# EAGLE design Pot4.4_MCP3008 (EAGLE 7.2.0)
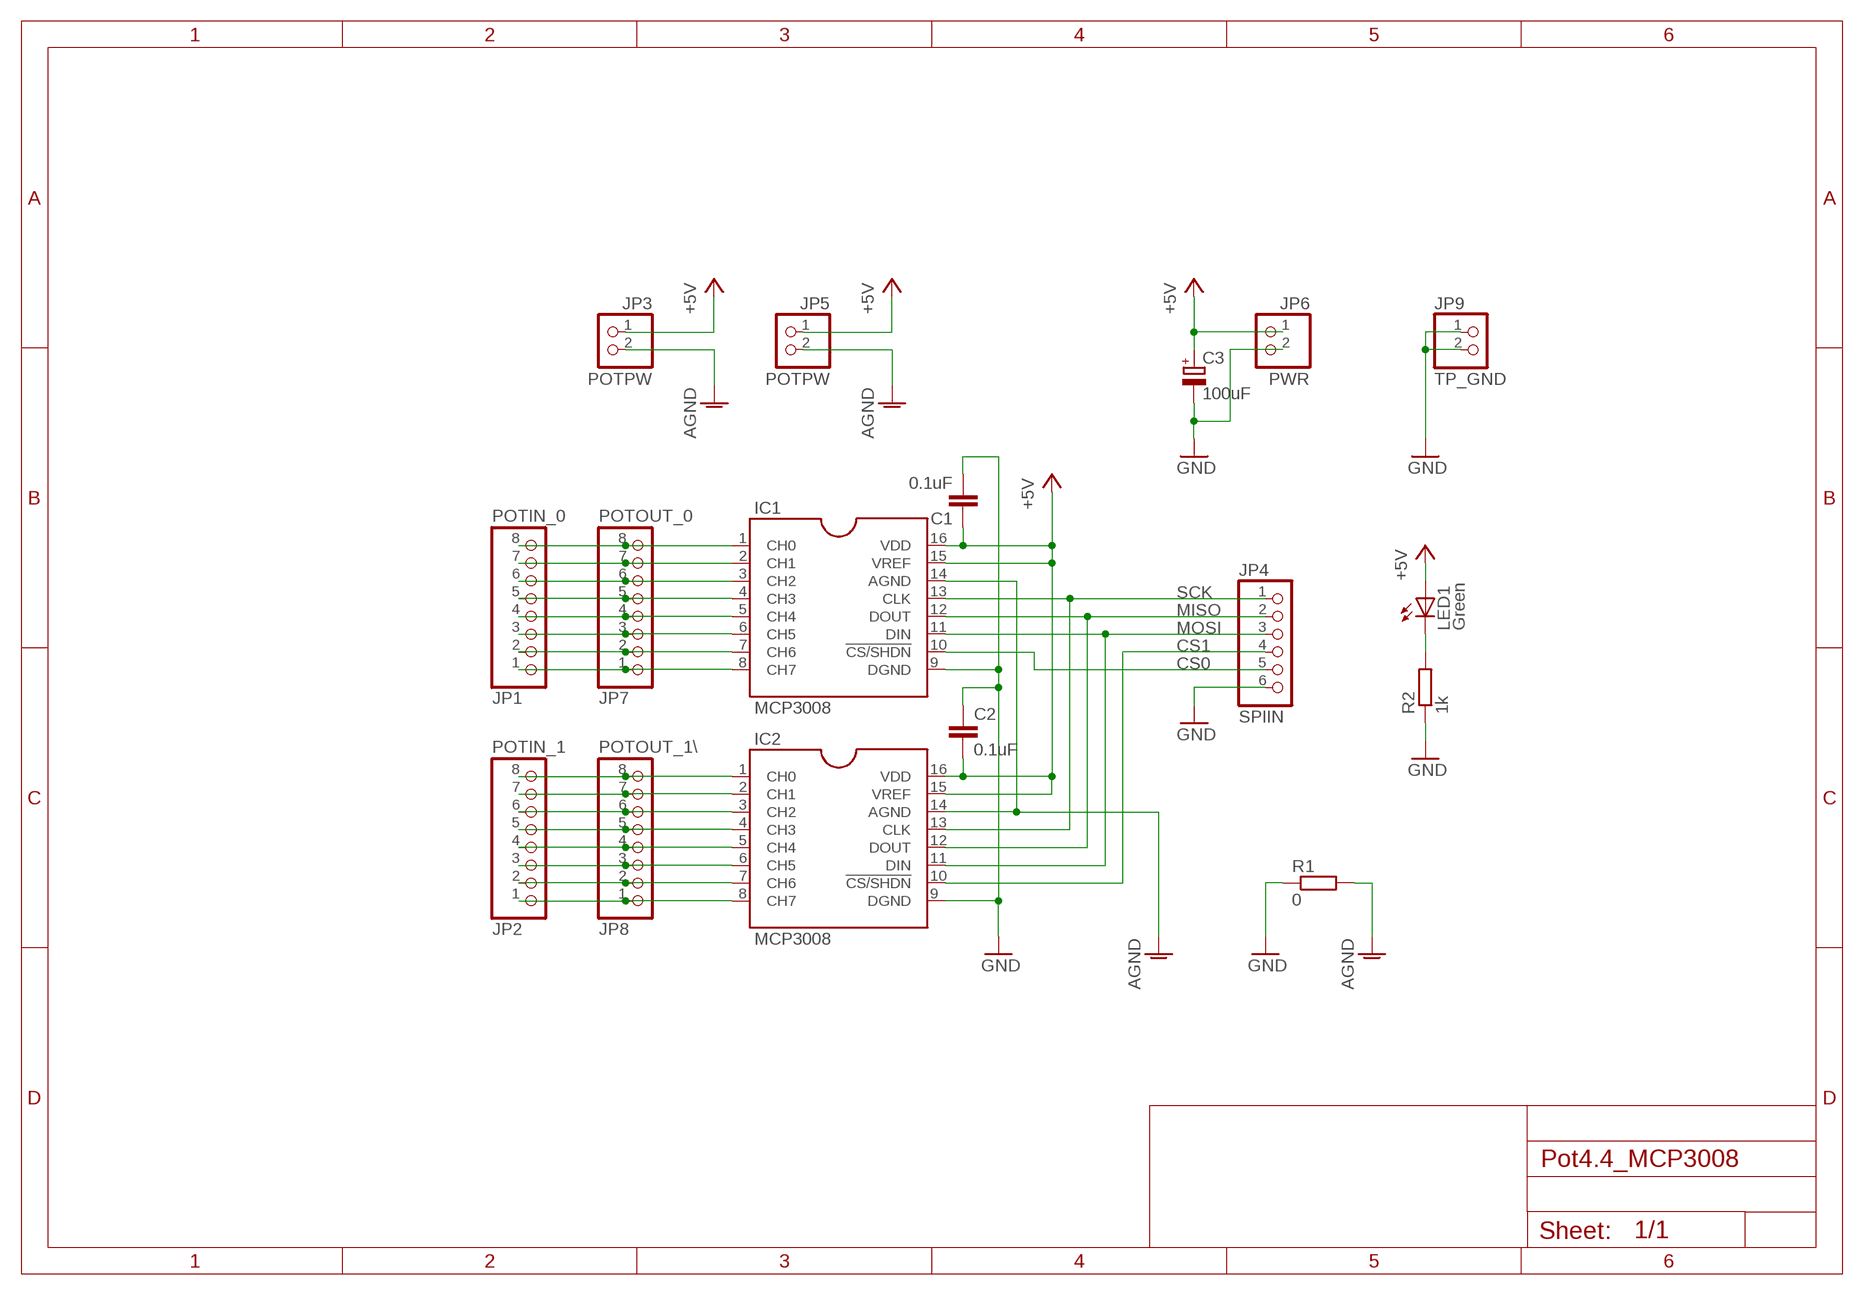
[diagram p0: schematic, sheet 1]

## Parts
C1  0.1uF  C-EU025-024X044  [C025-024X044]
C2  0.1uF  C-EU025-024X044  [C025-024X044]
C3  100uF  CPOL-EUSANYO_C  [SANYO-OSCON_C]
IC1  MCP3008  [MCP3008]
IC2  MCP3008  [MCP3008]
JP1  POTIN_0  PINHD-1X8/90  [1X08/90]
JP2  POTIN_1  PINHD-1X8/90  [1X08/90]
JP3  POTPW  PINHD-1X2/90  [1X02/90]
JP4  SPIIN  PINHD-1X6/90  [1X06/90]
JP5  POTPW  PINHD-1X2/90  [1X02/90]
JP6  PWR  PINHD-1X2/90  [1X02/90]
JP7  POTOUT_0  PINHD-1X8  [1X08]
JP8  POTOUT_1\  PINHD-1X8  [1X08]
JP9  TP_GND  PINHD-1X2  [1X02]
LED1  Green  LED3MM  [LED3MM]
R1  0  R-EU_0204/2V  [0204V]
R2  1k  R-EU_0207/7  [0207/7]

## Nets
+5V: C1.1 C2.2 C3.+ IC1.15(VREF) IC1.16(VDD) IC2.15(VREF) IC2.16(VDD) JP3.1 JP5.1 JP6.1 LED1.A
AGND: IC1.14(AGND) IC2.14(AGND) JP3.2 JP5.2 R1.2
CS0: IC1.10(!CS/SHDN) JP4.5
CS1: IC2.10(!CS/SHDN) JP4.4
GND: C1.2 C2.1 C3.- IC1.9(DGND) IC2.9(DGND) JP4.6 JP6.2 JP9.1 JP9.2 R1.1 R2.1
MISO: IC1.12(DOUT) IC2.12(DOUT) JP4.2
MOSI: IC1.11(DIN) IC2.11(DIN) JP4.3
N$1: IC1.1(CH0) JP1.8 JP7.8
N$2: IC1.2(CH1) JP1.7 JP7.7
N$3: IC1.3(CH2) JP1.6 JP7.6
N$4: IC1.4(CH3) JP1.5 JP7.5
N$5: IC1.5(CH4) JP1.4 JP7.4
N$6: IC1.6(CH5) JP1.3 JP7.3
N$7: IC1.7(CH6) JP1.2 JP7.2
N$8: IC1.8(CH7) JP1.1 JP7.1
N$9: IC2.1(CH0) JP2.8 JP8.8
N$10: IC2.2(CH1) JP2.7 JP8.7
N$11: IC2.3(CH2) JP2.6 JP8.6
N$12: IC2.4(CH3) JP2.5 JP8.5
N$13: IC2.5(CH4) JP2.4 JP8.4
N$14: IC2.6(CH5) JP2.3 JP8.3
N$15: IC2.7(CH6) JP2.2 JP8.2
N$16: IC2.8(CH7) JP2.1 JP8.1
N$18: LED1.K(C) R2.2
SCK: IC1.13(CLK) IC2.13(CLK) JP4.1

## Library data of the parts
C1 C2 = rcl:C-EU: CAPACITOR, European symbol
C3 = rcl:CPOL-EU: POLARIZED CAPACITOR, European symbol
IC1 IC2 = mylib2:MCP3008
JP1 JP2 JP7 JP8 = pinhead:PINHD-1X8: PIN HEADER
JP3 JP5 JP6 JP9 = pinhead:PINHD-1X2: PIN HEADER
JP4 = pinhead:PINHD-1X6: PIN HEADER
LED1 = led:LED: LED OSRAM: - CHIPLED LG R971, LG N971, LY N971, LG Q971, LY Q971, LO R971, LY R971 LH N974, LH R974 LS Q976, LO Q976, LY Q976 LO Q996 - Hyper CHIPLED LW Q18S LB Q993, LB Q99A, LB R99A - SideLED LS A670, LO A670, LY A670, LG A670, LP A670 LB A673, LV A673, LT A673, LW A673 LH A674 LY A675 LS A676, LA A676, LO A676, LY A676, LW A676 LS A679, LY A679, LG A679 - Hyper Micro SIDELED® LS Y876, LA Y876, LO Y876, LY Y876 LT Y87S - SmartLED LW L88C, LW L88S LB L89C, LB L89S, LG L890 LS L89K, LO L89K, LY L89K LS L896, LA L896, LO L896, LY L896 - TOPLED LS T670, LO T670, LY T670, LG T670, LP T670 LSG T670, LSP T670, LSY T670, LOP T670, LYG T670 LG T671, LOG T671, LSG T671 LB T673, LV T673, LT T673, LW T673 LH T674 LS T676, LA T676, LO T676, LY T676, LB T676, LH T676, LSB T676, LW T676 LB T67C, LV T67C, LT T67C, LS T67K, LO T67K, LY T67K, LW E67C LS E67B, LA E67B, LO E67B, LY E67B, LB E67C, LV E67C, LT E67C LW T67C LS T679, LY T679, LG T679 LS T770, LO T770, LY T770, LG T770, LP T770 LB T773, LV T773, LT T773, LW T773 LH T774 LS E675, LA E675, LY E675, LS T675 LS T776, LA T776, LO T776, LY T776, LB T776 LHGB T686 LT T68C, LB T68C - Hyper Mini TOPLED® LB M676 - Mini TOPLED Santana® LG M470 LS M47K, LO M47K, LY M47K Source: http://www.osram.convergy.de LUXEON: - LUMILED® LXK2-PW12-R00, LXK2-PW12-S00, LXK2-PW14-U00, LXK2-PW14-V00 LXK2-PM12-R00, LXK2-PM12-S00, LXK2-PM14-U00 LXK2-PE12-Q00, LXK2-PE12-R00, LXK2-PE12-S00, LXK2-PE14-T00, LXK2-PE14-U00 LXK2-PB12-K00, LXK2-PB12-L00, LXK2-PB12-M00, LXK2-PB14-N00, LXK2-PB14-P00, LXK2-PB14-Q00 LXK2-PR12-L00, LXK2-PR12-M00, LXK2-PR14-Q00, LXK2-PR14-R00 LXK2-PD12-Q00, LXK2-PD12-R00, LXK2-PD12-S00 LXK2-PH12-R00, LXK2-PH12-S00 LXK2-PL12-P00, LXK2-PL12-Q00, LXK2-PL12-R00 Source: www.luxeon.com KINGBRIGHT: KA-3528ASYC Source: www.kingbright.com
R1 R2 = rcl:R-EU_: RESISTOR, European symbol

## Board
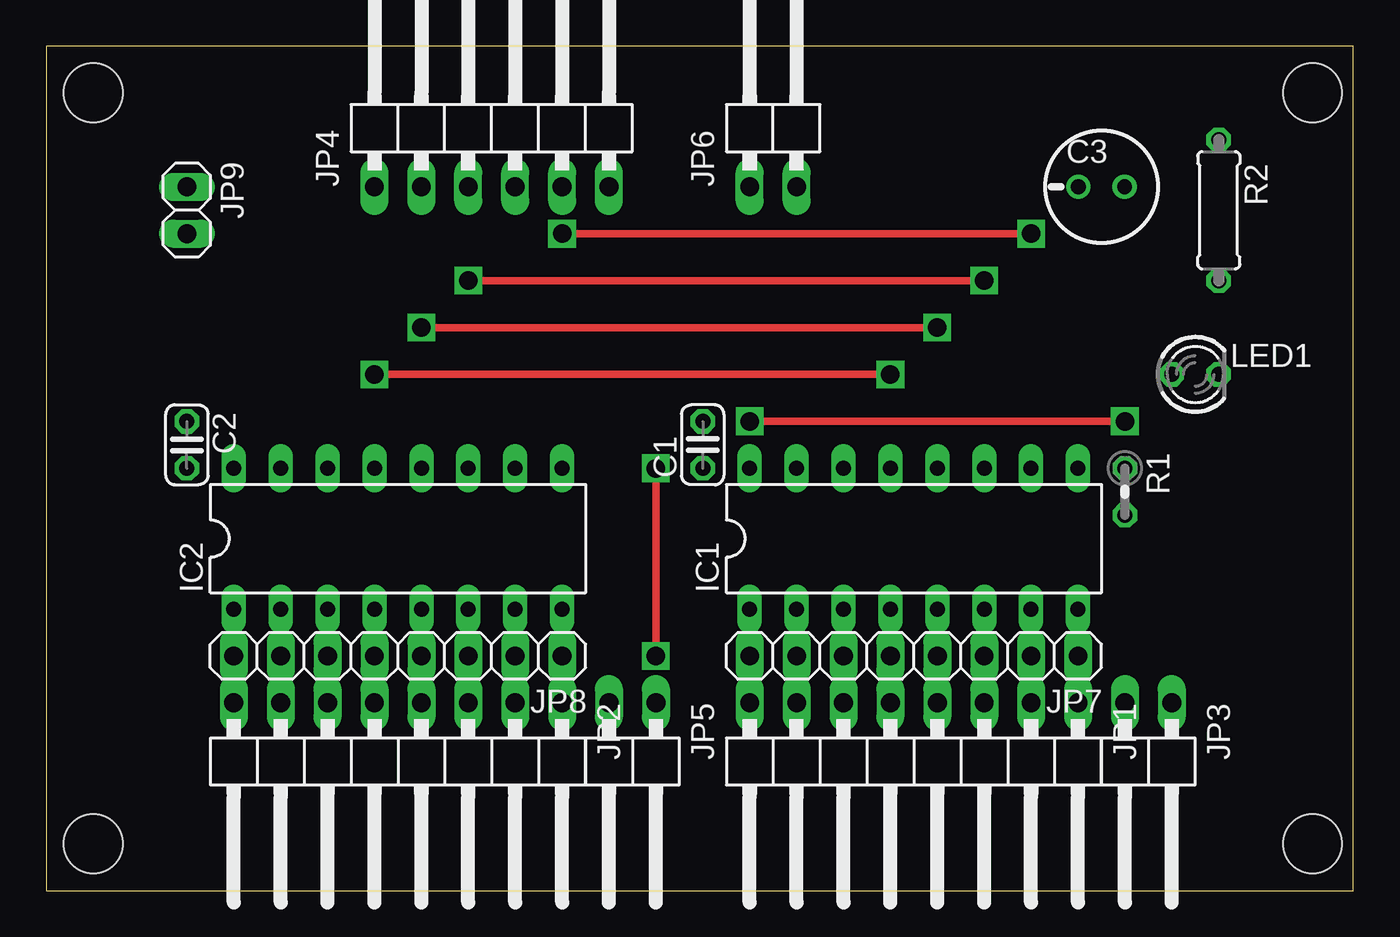
[diagram p1: board, top side]
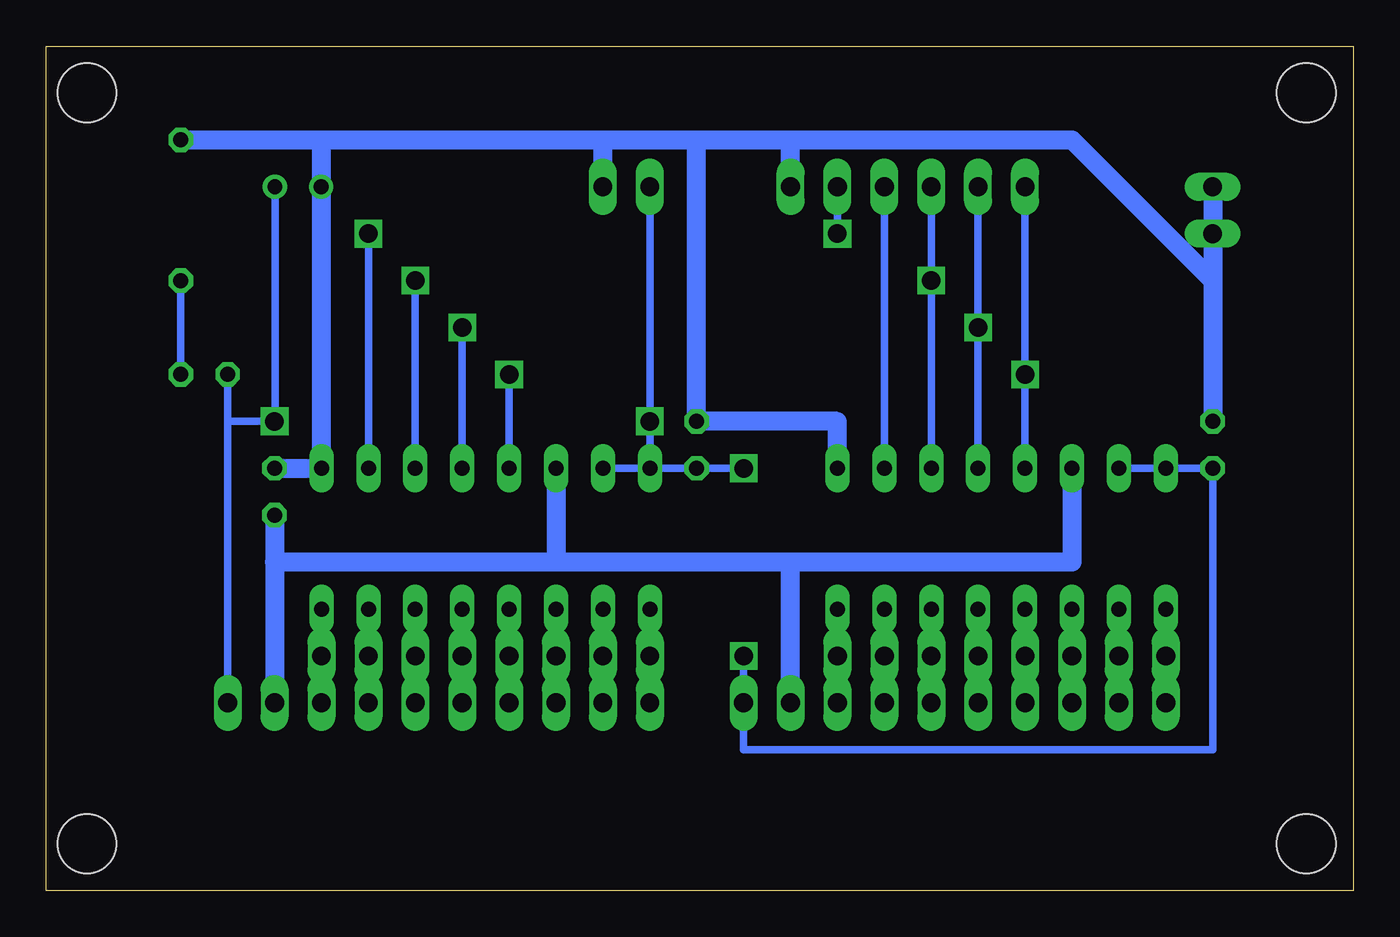
[diagram p2: board, bottom side, seen from below]

Size 70.79 x 45.71 mm. Coordinates in mm from the lower left corner, seen from the top.
Outline: 0,0 70.79,0 70.79,45.71 0,45.71 0,0
Copper layers (1*16): Top 0.035mm / dielectric 1.5mm / Bottom 0.035mm
Design rules "default": minimum track width 10mil, minimum drill 24mil, track to track 8mil, track to pad 8mil, pad to pad 8mil, via to via 8mil, smd to smd 8mil, copper to edge 40mil, drill to drill 8mil, minimum pad ring 10mil, minimum via ring 8mil, stop-mask expansion 4mil, vias tented up to drill 0mil, thermal gap 10mil
Holes 3.2 mm at 2.54,2.54 68.58,2.54 68.58,43.18 2.54,43.18

### Footprints (pad centres in the part's own frame; a part is rotated, then mirrored left to right if it is on the bottom)
C025-024X044 = drill 0.813 octagon: 1 -1.27,0; 2 1.27,0
SANYO-OSCON_C = drill 0.8 pad 1.27: + 1.25,0; - -1.25,0
MCP3008 = drill 0.813 long: 1 -8.89,-3.81; 2 -6.35,-3.81; 3 -3.81,-3.81; 4 -1.27,-3.81; 5 1.27,-3.81; 6 3.81,-3.81; 7 6.35,-3.81; 8 8.89,-3.81; 9 8.89,3.81; 10 6.35,3.81; 11 3.81,3.81; 12 1.27,3.81; 13 -1.27,3.81; 14 -3.81,3.81; 15 -6.35,3.81; 16 -8.89,3.81
1X08/90 = drill 1.016 long: 1 -8.89,-3.81; 2 -6.35,-3.81; 3 -3.81,-3.81; 4 -1.27,-3.81; 5 1.27,-3.81; 6 3.81,-3.81; 7 6.35,-3.81; 8 8.89,-3.81
1X02/90 = drill 1.016 long: 1 -1.27,-3.81; 2 1.27,-3.81
1X06/90 = drill 1.016 long: 1 -6.35,-3.81; 2 -3.81,-3.81; 3 -1.27,-3.81; 4 1.27,-3.81; 5 3.81,-3.81; 6 6.35,-3.81
1X08 = drill 1.016 long: 1 -8.89,0; 2 -6.35,0; 3 -3.81,0; 4 -1.27,0; 5 1.27,0; 6 3.81,0; 7 6.35,0; 8 8.89,0
1X02 = drill 1.016 long: 1 -1.27,0; 2 1.27,0
LED3MM = drill 0.813 octagon: A -1.27,0; K 1.27,0
0204V = drill 0.813 octagon: 1 -1.27,0; 2 1.27,0
0207/7 = drill 0.813 octagon: 1 -3.81,0; 2 3.81,0

### Placement (x,y rotation side)
C1  35.56,24.13 90 top
C2  7.62,24.13 270 top
C3  57.15,38.1 0 top
IC1  46.99,19.05 0 top
IC2  19.05,19.05 0 top
JP1  46.99,6.35 180 top
JP2  19.05,6.35 180 top
JP3  59.69,6.35 180 top
JP4  24.13,41.91 0 top
JP5  31.75,6.35 180 top
JP6  39.37,41.91 0 top
JP7  46.99,12.7 180 top
JP8  19.05,12.7 180 top
JP9  7.62,36.83 270 top
LED1  62.23,27.94 0 top
R1  58.42,21.59 270 top
R2  63.5,36.83 270 top

### Tracks (layer width: path | path; a pad name or v marks a point on that pad's centre or on a via)
+5V  (via drill 1)
  Top 0.406: v58.42,25.4 v38.1,25.4 | v33.02,22.86 v33.02,12.7
  Bottom 0.406: IC1.16 C1.1 v33.02,22.86 | JP6.1 v38.1,25.4 IC1.16 | IC1.15 IC1.16 | JP3.1 60.96,25.4 | 60.96,25.4 v58.42,25.4 58.4,25.42 C3.+ | IC2.15 IC2.16 C2.2 7.62,7.62 33.02,7.62 JP5.1 v33.02,12.7 | LED1.A 60.96,25.4
AGND
  Bottom 1.016: JP5.2 30.48,17.78 | 30.48,17.78 43.18,17.78 | 43.18,17.78 58.42,17.78 | 58.42,17.78 JP3.2 | R1.2 58.42,17.78 | IC1.14 43.18,17.78 | IC2.14 15.24,17.78 30.48,17.78
CS0  (via drill 1)
  Top 0.406: v27.94,35.56 v53.34,35.56
  Bottom 0.406: v53.34,35.56 IC1.10 | JP4.5 v27.94,35.56
CS1
  Bottom 0.406: JP4.4 IC2.10
GND
  Bottom 0.406: 55.9,22.88 IC1.9
  Bottom 1.016: JP6.2 40.64,40.64 | 40.64,40.64 35.56,40.64 | 35.56,40.64 30.48,40.64 | 30.48,40.64 15.24,40.64 7.62,33.02 | 7.62,33.02 C2.1 | IC2.9 27.94,25.4 C1.2 35.56,40.64 | 55.9,22.88 C3.- 55.88,38.1 55.88,40.64 | R2.1 55.88,40.64 | 55.88,40.64 40.64,40.64 | JP4.6 30.48,40.64 | R1.1 IC1.9 | 7.62,33.02 JP9.2 JP9.1
MISO  (via drill 1)
  Top 0.406: v48.26,30.48 v20.32,30.48
  Bottom 0.406: IC2.12 v20.32,30.48 JP4.2 | IC1.12 v48.26,30.48
MOSI  (via drill 1)
  Top 0.406: v50.8,33.02 v22.86,33.02
  Bottom 0.406: IC2.11 v22.86,33.02 JP4.3 | IC1.11 v50.8,33.02
N$1
  Bottom 0.406: JP1.8 JP7.8 IC1.1
N$2
  Bottom 0.406: JP1.7 JP7.7 IC1.2
N$3
  Bottom 0.406: JP1.6 JP7.6 IC1.3
N$4
  Bottom 0.406: JP1.5 JP7.5 IC1.4
N$5
  Bottom 0.406: JP1.4 JP7.4 IC1.5
N$6
  Bottom 0.406: JP1.3 JP7.3 IC1.6
N$7
  Bottom 0.406: JP1.2 JP7.2 IC1.7
N$8
  Bottom 0.406: JP1.1 JP7.1 IC1.8
N$9
  Bottom 0.406: JP2.8 JP8.8 IC2.1
N$10
  Bottom 0.406: JP2.7 JP8.7 IC2.2
N$11
  Bottom 0.406: JP2.6 JP8.6 IC2.3
N$12
  Bottom 0.406: JP2.5 JP8.5 IC2.4
N$13
  Bottom 0.406: JP2.4 JP8.4 IC2.5
N$14
  Bottom 0.406: JP2.3 JP8.3 IC2.6
N$15
  Bottom 0.406: JP2.2 JP8.2 IC2.7
N$16
  Bottom 0.406: JP2.1 JP8.1 IC2.8
N$18
  Bottom 0.406: R2.2 LED1.K
SCK  (via drill 1)
  Top 0.406: v45.72,27.94 v17.78,27.94
  Bottom 0.406: IC2.13 v17.78,27.94 JP4.1 | IC1.13 v45.72,27.94